# EAGLE design expander (EAGLE 6.5.0)
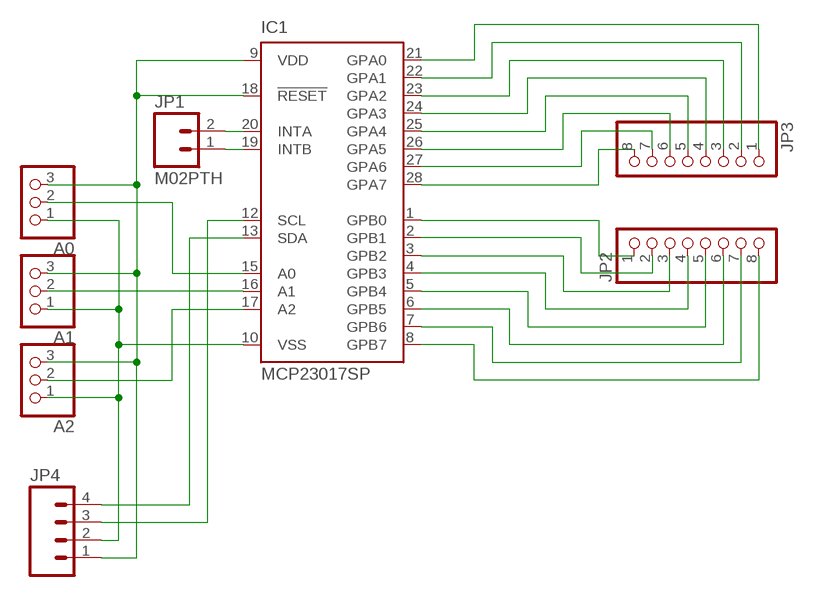
[diagram p0: schematic, sheet 1]

## Parts
A0  PINHD-1X3  [1X03]
A1  PINHD-1X3  [1X03]
A2  PINHD-1X3  [1X03]
IC1  MCP23017SP  [DIL28-3]
JP1  M02PTH  [1X02]
JP2  PINHD-1X8  [1X08]
JP3  PINHD-1X8  [1X08]
JP4  M04POLAR  [MOLEX-1X4]

## Nets
GND: A0.1 A1.1 A2.1 IC1.10(VSS) JP4.2
N$1: A0.2 IC1.15(A0)
N$2: A1.2 IC1.16(A1)
N$3: A2.2 IC1.17(A2)
N$6: IC1.12(SCL) JP4.3
N$7: IC1.13(SDA) JP4.4
N$8: IC1.28(GPA7) JP3.8
N$9: IC1.1(GPB0) JP2.1
N$10: IC1.27(GPA6) JP3.7
N$11: IC1.2(GPB1) JP2.2
N$12: IC1.26(GPA5) JP3.6
N$13: IC1.25(GPA4) JP3.5
N$14: IC1.24(GPA3) JP3.4
N$15: IC1.23(GPA2) JP3.3
N$16: IC1.22(GPA1) JP3.2
N$17: IC1.21(GPA0) JP3.1
N$18: IC1.3(GPB2) JP2.3
N$19: IC1.4(GPB3) JP2.4
N$20: IC1.5(GPB4) JP2.5
N$21: IC1.6(GPB5) JP2.6
N$22: IC1.7(GPB6) JP2.7
N$23: IC1.8(GPB7) JP2.8
N$24: IC1.19(INTB) JP1.1
N$25: IC1.20(INTA) JP1.2
VCC: A0.3 A1.3 A2.3 IC1.9(VDD) IC1.18(!RESET) JP4.1

## Library data of the parts
A0 A1 A2 = pinhead:PINHD-1X3: PIN HEADER
IC1 = microchip:MCP23017: http://ww1.microchip.com/downloads/en/DeviceDoc/21952a.pdf Source: http://ww1.microchip.com/downloads/en/DeviceDoc/21952a.pdf; MF: MICROCHIP; MPN: MCP23017-E/SP; OC_FARNELL: 1332088; OC_NEWARK: 31K2959
JP1 = SparkFun-Connectors:M02: Standard 2-pin 0.1" header. Use with - straight break away headers ( PRT-00116) - right angle break away headers (PRT-00553) - swiss pins (PRT-00743) - machine pins (PRT-00117) - female headers (PRT-00115) Molex polarized connector foot print use with: PRT-08233 with associated crimp pins and housings. 2.54_SCREWTERM for use with PRT-10571. 3.5mm Screw Terminal footprints for PRT-08084 5mm Screw Terminal footprints for use with PRT-08433
JP2 JP3 = pinhead:PINHD-1X8: PIN HEADER
JP4 = SparkFun-Connectors:M04: Header 4 Standard 4-pin 0.1" header. Use with straight break away headers (SKU : PRT-00116), right angle break away headers (PRT-00553), swiss pins (PRT-00743), machine pins (PRT-00117), and female headers (PRT-00115). Molex polarized connector foot print use with SKU : PRT-08231 with associated crimp pins and housings. 1MM SMD Version SKU: PRT-10208

## Board
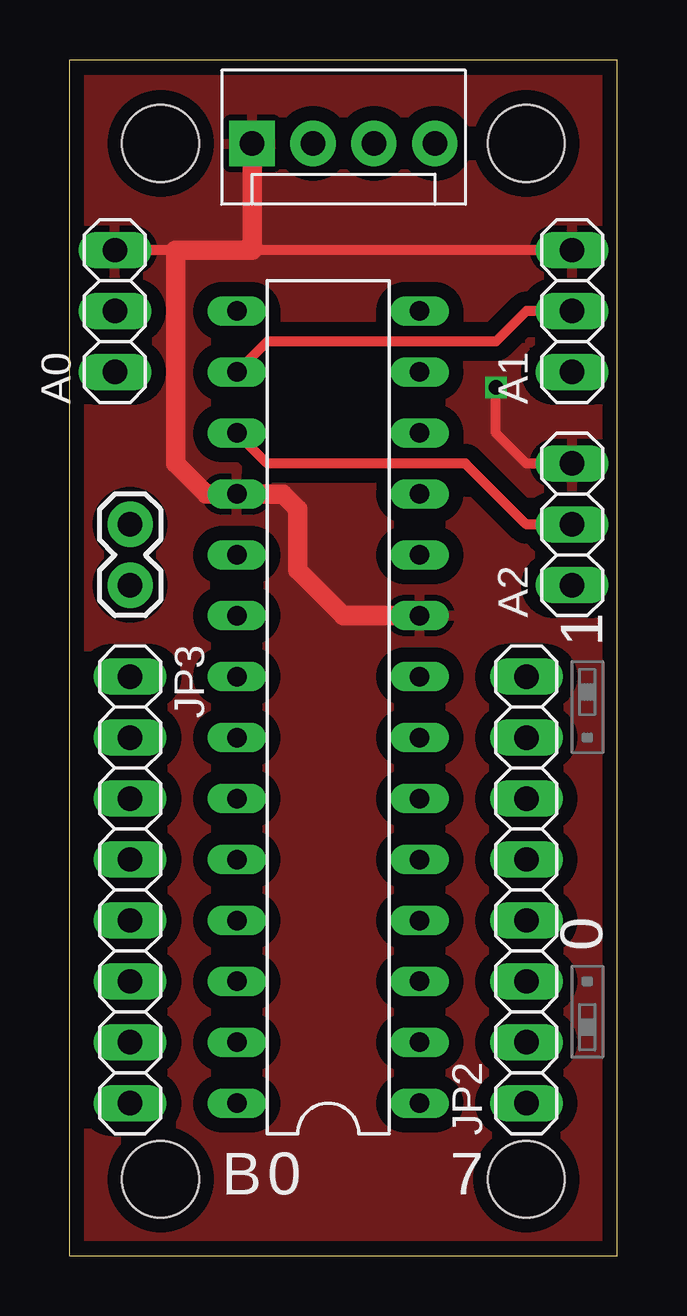
[diagram p1: board, top side]
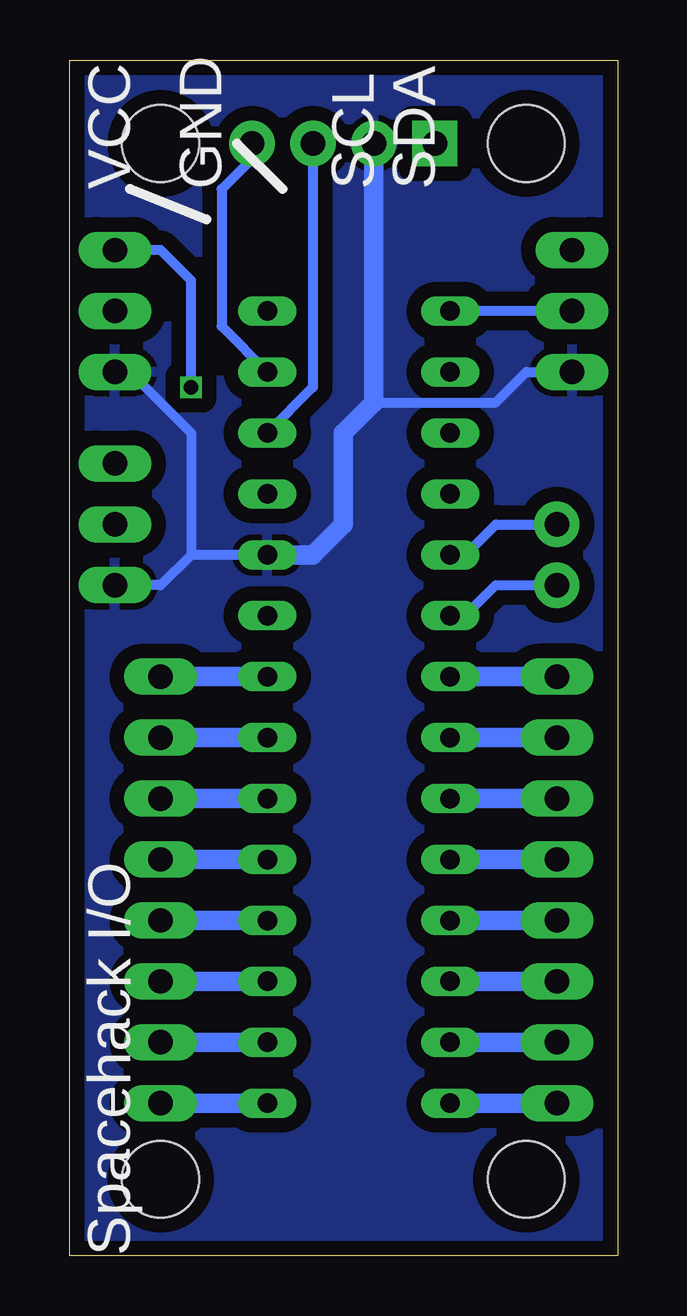
[diagram p2: board, bottom side, seen from below]

Size 22.84 x 49.84 mm. Coordinates in mm from the lower left corner, seen from the top.
Outline: 0,0 22.84,0 22.84,49.84 0,49.84 0,0
Copper layers (1*2*15*16): Top 0.035mm / dielectric 0.2mm / Route2 0.0175mm / dielectric 1.1mm / Route15 0.0175mm / dielectric 0.2mm / Bottom 0.035mm
Design rules "SeeedStudio_DRU_no_angle_20130527": minimum track width 6mil, minimum drill 12mil, track to track 6mil, track to pad 6mil, pad to pad 6mil, via to via 6mil, smd to smd 0mil, copper to edge 10mil, drill to drill 10mil, minimum pad ring 6mil, minimum via ring 6mil, stop-mask expansion 2mil, vias tented up to drill 25mil, thermal gap 10mil
Holes 3.2 mm at 19.05,46.35 3.81,3.17 3.81,46.35 19.05,3.17

### Footprints (pad centres in the part's own frame; a part is rotated, then mirrored left to right if it is on the bottom)
1X03 = drill 1.016 long: 1 -2.54,0; 2 0,0; 3 2.54,0
DIL28-3 = drill 0.813 long: 1 -16.51,-3.81; 2 -13.97,-3.81; 3 -11.43,-3.81; 4 -8.89,-3.81; 5 -6.35,-3.81; 6 -3.81,-3.81; 7 -1.27,-3.81; 8 1.27,-3.81; 9 3.81,-3.81; 10 6.35,-3.81; 11 8.89,-3.81; 12 11.43,-3.81; 13 13.97,-3.81; 14 16.51,-3.81; 15 16.51,3.81; 16 13.97,3.81; 17 11.43,3.81; 18 8.89,3.81; 19 6.35,3.81; 20 3.81,3.81; 21 1.27,3.81; 22 -1.27,3.81; 23 -3.81,3.81; 24 -6.35,3.81; 25 -8.89,3.81; 26 -11.43,3.81; 27 -13.97,3.81; 28 -16.51,3.81
1X02 = drill 1.016 pad 1.88: 1 0,0; 2 2.54,0
1X08 = drill 1.016 long: 1 -8.89,0; 2 -6.35,0; 3 -3.81,0; 4 -1.27,0; 5 1.27,0; 6 3.81,0; 7 6.35,0; 8 8.89,0
MOLEX-1X4 = drill 1.016 pad 1.88 square: 1 0,0 | drill 1.016 pad 1.88: 2 2.54,0; 3 5.08,0; 4 7.62,0

### Placement (x,y rotation side)
A0  1.91,39.37 90 top
A1  20.95,39.37 90 top
A2  20.95,30.48 90 top
IC1  10.79,22.86 90 top
JP1  2.54,30.48 270 top
JP2  19.05,15.24 90 top
JP3  2.54,15.24 270 top
JP4  7.62,46.35 0 top
U$3  [JUMP3_DESC_LEFT]  21.59,10.16 90 top
U$4  [JUMP3_DESC_RIGHT]  21.59,22.86 90 top

### Tracks (layer width: path | path; a pad name or v marks a point on that pad's centre or on a via)
GND
  Bottom 0.406: 10.16,35.56 5.08,35.56 3.81,36.83 A0.1 | IC1.10 17.78,29.21 | 17.78,29.21 19.05,27.94 A2.1 | A1.1 20.32,36.83 17.78,34.29 17.78,29.21
  Bottom 0.813: IC1.10 12.7,29.21 11.43,30.48 11.43,34.29 10.16,35.56 JP4.2
  pour Bottom (isolate 0.61): 22.86,0 22.86,49.53 0,49.53 0,0
N$1
  Bottom 0.406: A0.2 IC1.15
N$2
  Top 0.406: A1.2 19.05,39.37 17.78,38.1 8.26,38.1 IC1.16
N$3
  Top 0.406: A2.2 19.05,30.48 16.51,33.02 8.26,33.02 IC1.17
N$6
  Bottom 0.406: JP4.3 12.7,36.2 IC1.12
N$7
  Bottom 0.406: JP4.4 15.24,45.72 16.51,44.45 16.51,38.73 IC1.13
N$8
  Bottom 0.813: IC1.28 JP3.8
N$9
  Bottom 0.813: IC1.1 JP2.1
N$10
  Bottom 0.813: IC1.27 JP3.7
N$11
  Bottom 0.813: JP2.2 IC1.2
N$12
  Bottom 0.813: IC1.26 JP3.6
N$13
  Bottom 0.813: IC1.25 JP3.5
N$14
  Bottom 0.813: IC1.24 JP3.4
N$15
  Bottom 0.813: IC1.23 JP3.3
N$16
  Bottom 0.813: IC1.22 JP3.2
N$17
  Bottom 0.813: IC1.21 JP3.1
N$18
  Bottom 0.813: IC1.3 JP2.3
N$19
  Bottom 0.813: JP2.4 IC1.4
N$20
  Bottom 0.813: IC1.5 JP2.5
N$21
  Bottom 0.813: JP2.6 IC1.6
N$22
  Bottom 0.813: IC1.7 JP2.7
N$23
  Bottom 0.813: JP2.8 IC1.8
N$24
  Bottom 0.406: IC1.19 6.35,29.21 5.08,30.48 JP1.1
N$25
  Bottom 0.406: IC1.20 6.35,26.67 5.08,27.94 JP1.2
VCC  (via drill 0.6)
  Top 0.406: A1.3 7.62,41.91 | 4.45,41.91 A0.3 | A2.3 19.05,33.02 17.78,34.29 v17.78,36.2
  Top 0.813: JP4.1 7.62,41.91 4.45,41.91 4.45,33.02 5.71,31.75 IC1.18 8.89,31.75 9.53,31.11 9.53,28.57 11.43,26.67 IC1.9
  Bottom 0.406: v17.78,36.2 17.78,40.64 19.05,41.91 A1.3
  pour Top (isolate 0.61): 0,49.53 22.86,49.53 22.86,0 0,0

### Text on the board
tPlace: 1 | 0 | B | 0 | 7
bPlace: SDA | SCL | GND | VCC | Spacehack I/O
tValues: A